# EAGLE design ACESMorlandBargraph (EAGLE 9.3.0)
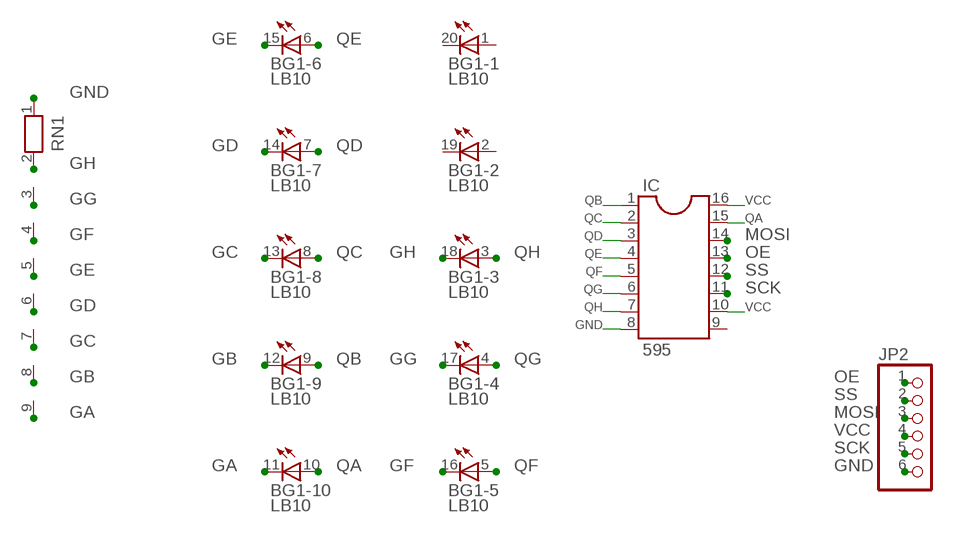
[diagram p0: schematic, sheet 1]

## Parts
BG1  LB10  [LB10]
IC  595  DIL16  [DIL16]
JP2  PINHD-1X6/90  [1X06/90]
RN1  RN08  [RN-9]

## Nets
GA: BG1.11(-10:C) RN1.9
GB: BG1.12(-9:C) RN1.8
GC: BG1.13(-8:C) RN1.7
GD: BG1.14(-7:C) RN1.6
GE: BG1.15(-6:C) RN1.5
GF: BG1.16(-5:C) RN1.4
GG: BG1.17(-4:C) RN1.3
GH: BG1.18(-3:C) RN1.2
GND: IC.8 JP2.6 RN1.1
MOSI: IC.14 JP2.3
OE: IC.13 JP2.1
QA: BG1.10(-10:A) IC.15
QB: BG1.9(-9:A) IC.1
QC: BG1.8(-8:A) IC.2
QD: BG1.7(-7:A) IC.3
QE: BG1.6(-6:A) IC.4
QF: BG1.5(-5:A) IC.5
QG: BG1.4(-4:A) IC.6
QH: BG1.3(-3:A) IC.7
SCK: IC.11 JP2.5
SS: IC.12 JP2.2
VCC: IC.10 IC.16 JP2.4
Unconnected: BG1.1(-1:A) BG1.2(-2:A) BG1.19(-2:C) BG1.20(-1:C) IC.9

## Library data of the parts
BG1 = led:LB10: LED BLOCK 10-LED bar graph, DIL, Siemens
IC = ic-package:DIL16: Dual In Line / Socket
JP2 = pinhead:PINHD-1X6: PIN HEADER
RN1 = resistor-net:RN08: RESISTOR NETWORK; OC_FARNELL: unknown; OC_NEWARK: unknown

## Board
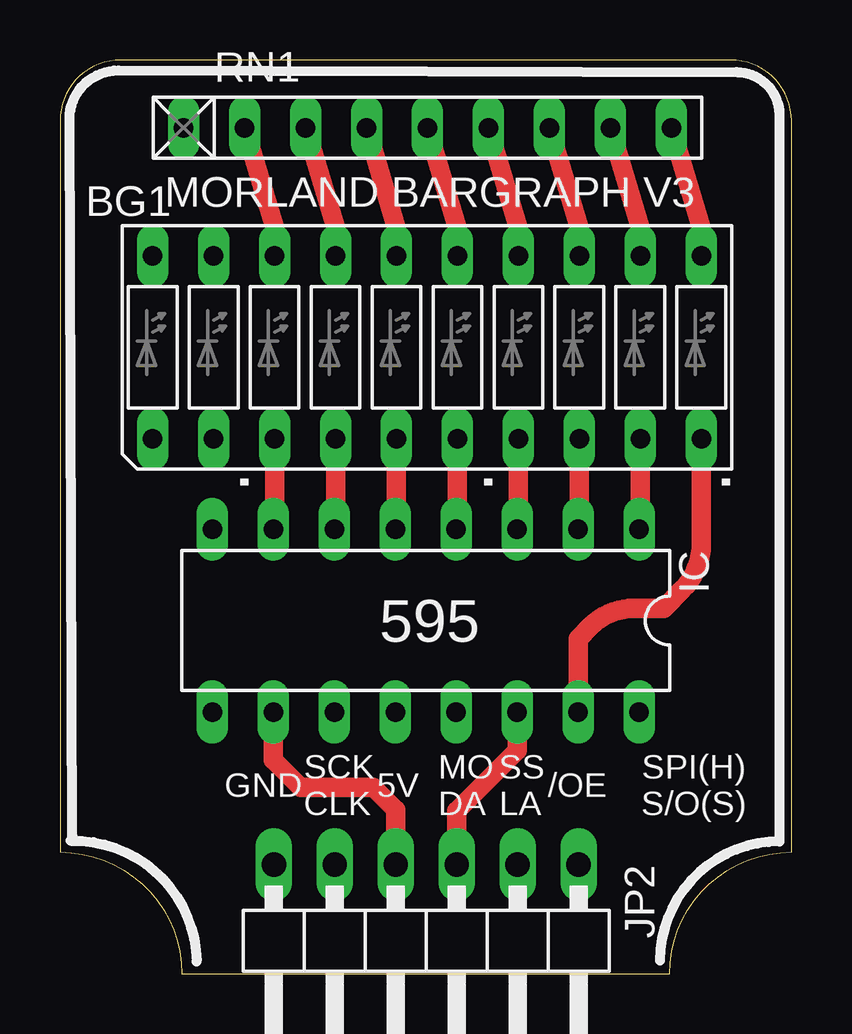
[diagram p1: board, top side]
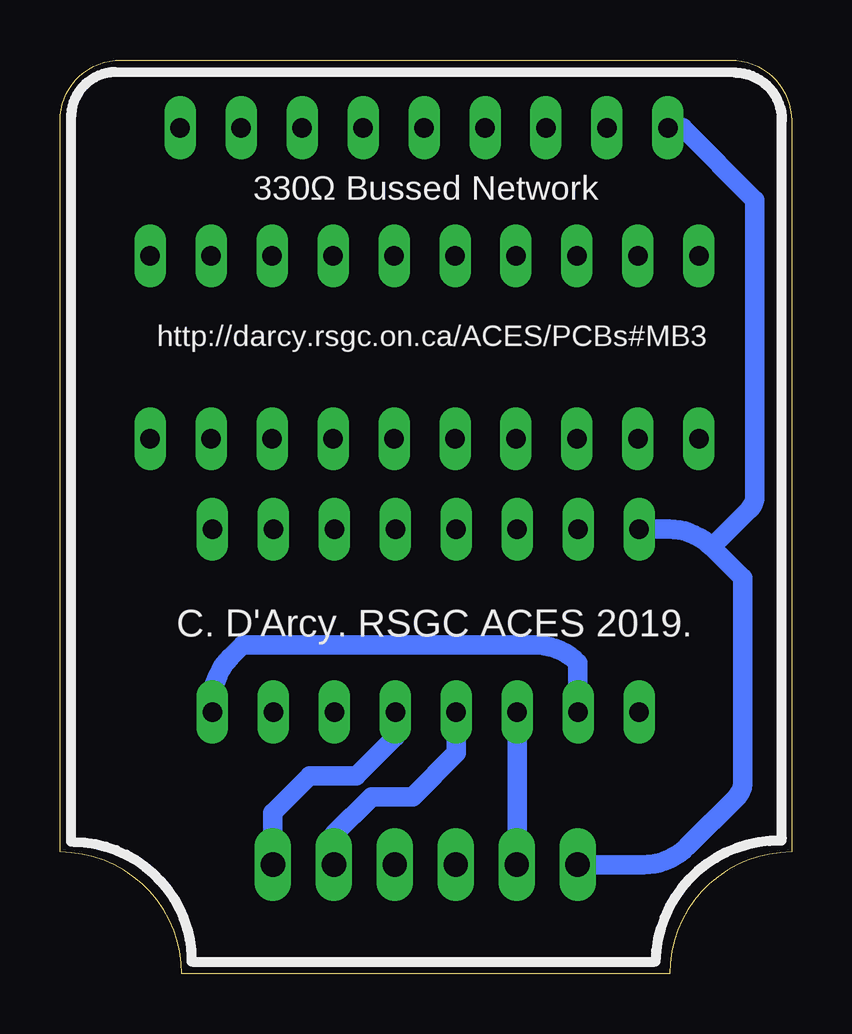
[diagram p2: board, bottom side, seen from below]

Size 30.48 x 38.1 mm. Coordinates in mm from the lower left corner, seen from the top.
Outline: 0,35.56 0,5.08 arc-90 5.08,0 25.4,0 arc-90 30.48,5.08 30.48,35.56 arc90 27.94,38.1 2.54,38.1 arc90 0,35.56
Copper layers (1*16): Top 0.035mm / dielectric 1.5mm / Bottom 0.035mm
Design rules "default": minimum track width 10mil, minimum drill 24mil, track to track 8mil, track to pad 8mil, pad to pad 8mil, via to via 8mil, smd to smd 8mil, copper to edge 40mil, drill to drill 8mil, minimum pad ring 10mil, minimum via ring 8mil, stop-mask expansion 4mil, vias tented up to drill 0mil, thermal gap 10mil

### Footprints (pad centres in the part's own frame; a part is rotated, then mirrored left to right if it is on the bottom)
LB10 = drill 0.813 long: 1 -11.43,-3.81; 2 -8.89,-3.81; 3 -6.35,-3.81; 4 -3.81,-3.81; 5 -1.27,-3.81; 6 1.27,-3.81; 7 3.81,-3.81; 8 6.35,-3.81; 9 8.89,-3.81; 10 11.43,-3.81; 11 11.43,3.81; 12 8.89,3.81; 13 6.35,3.81; 14 3.81,3.81; 15 1.27,3.81; 16 -1.27,3.81; 17 -3.81,3.81; 18 -6.35,3.81; 19 -8.89,3.81; 20 -11.43,3.81
DIL16 = drill 0.813 long: 1 -8.89,-3.81; 2 -6.35,-3.81; 3 -3.81,-3.81; 4 -1.27,-3.81; 5 1.27,-3.81; 6 3.81,-3.81; 7 6.35,-3.81; 8 8.89,-3.81; 9 8.89,3.81; 10 6.35,3.81; 11 3.81,3.81; 12 1.27,3.81; 13 -1.27,3.81; 14 -3.81,3.81; 15 -6.35,3.81; 16 -8.89,3.81
1X06/90 = drill 1.016 long: 1 -6.35,-3.81; 2 -3.81,-3.81; 3 -1.27,-3.81; 4 1.27,-3.81; 5 3.81,-3.81; 6 6.35,-3.81
RN-9 = drill 0.813 long: 1 -10.16,0; 2 -7.62,0; 3 -5.08,0; 4 -2.54,0; 5 0,0; 6 2.54,0; 7 5.08,0; 8 7.62,0; 9 10.16,0

### Placement (x,y rotation side)
BG1  15.29,26.12 0 top
IC  15.24,14.73 180 top
JP2  15.26,0.75 180 top
RN1  15.31,35.28 0 top

### Tracks (layer width: path | path; a pad name or v marks a point on that pad's centre or on a via)
GA
  Top 0.813: BG1.11 26.72,31.11 RN1.9
GB
  Top 0.813: BG1.12 24.18,31.11 RN1.8
GC
  Top 0.813: BG1.13 21.64,31.11 RN1.7
GD
  Top 0.813: BG1.14 19.1,31.11 RN1.6
GE
  Top 0.813: BG1.15 16.56,31.11 RN1.5
GF
  Top 0.813: BG1.16 14.02,31.11 RN1.4
GG
  Top 0.813: BG1.17 11.48,31.11 RN1.3
GH
  Top 0.813: BG1.18 8.94,31.11 RN1.2
GND
  Bottom 0.813: IC.8 5.12,18.54 arc45 3.32,17.8 | 3.32,17.8 2.03,16.51 2.03,7.98 arc45 2.29,7.37 4.34,5.32 arc45 6.18,4.55 JP2.6 | RN1.1 4.54,35.28 1.52,32.26 1.52,19.93 arc45 1.76,19.36 3.32,17.8
MOSI
  Top 0.813: JP2.3 16.53,6.81 19.05,9.33 IC.14
OE
  Bottom 0.813: IC.13 16.51,9.89 18.14,8.26 20.07,8.26 21.61,6.72 JP2.1
QA
  Top 0.813: IC.15 21.59,13.97 22.12,14.5 arc-45 23.91,15.24 25.15,15.24 25.93,16.02 arc45 26.72,17.94 BG1.10
QB
  Top 0.813: BG1.9 24.18,18.59 IC.1
QC
  Top 0.813: BG1.8 21.64,18.59 IC.2
QD
  Top 0.813: BG1.7 19.1,18.59 IC.3
QE
  Top 0.813: BG1.6 16.56,18.59 IC.4
QF
  Top 0.813: BG1.5 14.02,18.59 IC.5
QG
  Top 0.813: BG1.4 11.48,18.59 IC.6
QH
  Top 0.813: BG1.3 8.94,18.59 IC.7
SCK
  Bottom 0.813: IC.11 11.43,4.58 JP2.5
SS
  Bottom 0.813: IC.12 13.97,9.21 15.79,7.39 17.5,7.39 19.07,5.81 JP2.2
VCC
  Top 0.813: JP2.4 13.99,6.84 13.06,7.77 10.04,7.77 8.89,8.92 IC.10
  Bottom 0.813: IC.16 24.13,11.39 arc45 23.39,13.19 22.86,13.72 10.7,13.72 arc45 8.91,12.97 8.91,10.94 IC.10

### Text on the board
tSilk: MORLAND BARGRAPH V3 | . | . | . | 595 | SCK | MO | SS | SPI(H) | GND | CLK | 5V | DA | LA | /OE | S/O(S)
bSilk: 330Ω Bussed Network | http://darcy.rsgc.on.ca/ACES/PCBs#MB3 | C. D'Arcy. RSGC ACES 2019.